# EAGLE design 1.0_batchpcb (EAGLE 5.11)
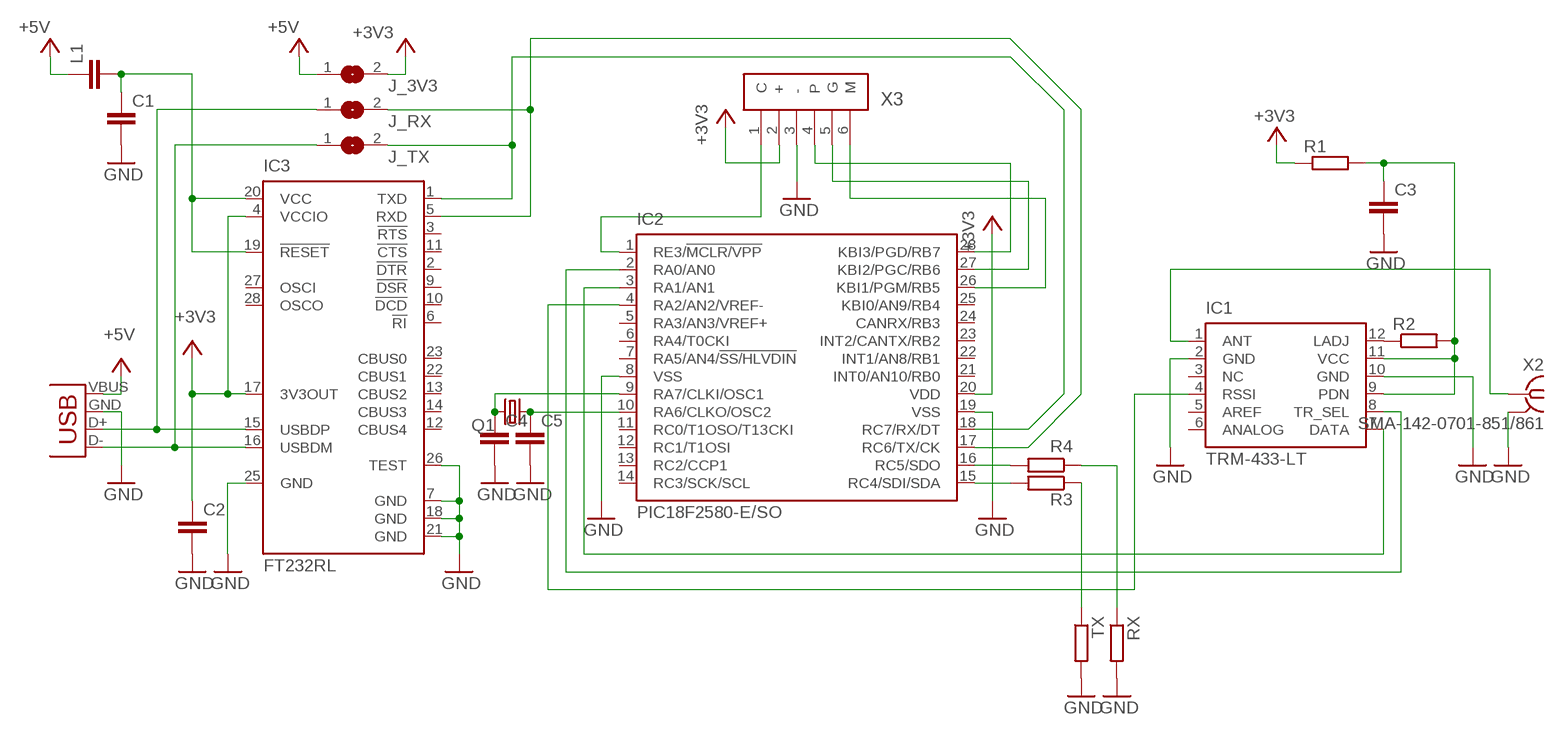
[diagram p0: schematic, sheet 1]

## Parts
C1  C-EUC0805K  [C0805K]
C2  C-EUC0805K  [C0805K]
C3  C-EUC0805K  [C0805K]
C4  C-EUC0805K  [C0805K]
C5  C-EUC0805K  [C0805K]
IC1  TRM-433-LT  [TRM-XXX-LT]
IC2  PIC18F2580-E/SO  [SO28W]
IC3  FT232RL  [SSOP28]
J_3V3  SJ  [SJ]
J_RX  SJ  [SJ]
J_TX  SJ  [SJ]
L1  C-EUC0805K  [C0805K]
Q1  CRYSTALSM49  [SM49]
R1  R-EU_M0805  [M0805]
R2  R-EU_M0805  [M0805]
R3  R-EU_M0805  [M0805]
R4  R-EU_M0805  [M0805]
RX  R-EU_M0805  [M0805]
TX  R-EU_M0805  [M0805]
X1  USB-A-H  [USB-A-H]
X2  SMA-142-0701-851/861  [J502-ND-142-0701-851/861]
X3  ICSP_HEADER  [6-PIN_HEADER]

## Nets
+3V3: C2.1 C3.1 IC1.9(PDN) IC1.11(VCC) IC2.20(VDD) IC3.4(VCCIO) IC3.17(3V3OUT) J_3V3.2 R1.1 R1.2 R2.2 X3.2(+)
+5V: J_3V3.1 L1.1 X1.VBUS(GND)
GND: C1.2 C2.2 C3.2 C4.2 C5.2 IC1.2(GND) IC1.10(GND) IC2.8(VSS) IC2.19(VSS) IC3.7(GND) IC3.18(GND) IC3.21(GND) IC3.25(GND) IC3.26(TEST) RX.2 TX.2 X1.GND(VBUS) X2.G@1(GND) X3.3(-)
N$1: IC1.1(ANT) X2.1
N$2: IC2.18(RC7/RX/DT) IC3.1(TXD) J_TX.2
N$3: IC2.17(RC6/TX/CK) IC3.5(RXD) J_RX.2
N$4: IC2.1(RE3/!MCLR/VPP) X3.1(C)
N$5: IC2.28(KBI3/PGD/RB7) X3.4(P)
N$6: IC2.27(KBI2/PGC/RB6) X3.5(G)
N$7: IC2.26(KBI1/PGM/RB5) X3.6(M)
N$8: IC1.7(DATA) IC2.3(RA1/AN1)
N$9: IC1.8(TR_SEL) IC2.2(RA0/AN0)
N$10: IC1.4(RSSI) IC2.4(RA2/AN2/VREF-)
N$11: IC1.12(LADJ) R2.1
N$12: IC3.16(USBDM) J_TX.1 X1.D-(D+)
N$13: IC2.16(RC5/SDO) R4.2
N$14: IC3.15(USBDP) J_RX.1 X1.D+(D-)
N$15: IC2.15(RC4/SDI/SDA) R3.2
N$16: C1.1 IC3.19(!RESET) IC3.20(VCC) L1.2
N$17: C4.1 IC2.9(RA7/CLKI/OSC1) Q1.2
N$18: R4.1 RX.1
N$19: R3.1 TX.1
N$21: C5.1 IC2.10(RA6/CLKO/OSC2) Q1.1
Unconnected: IC1.3(NC) IC1.5(AREF) IC1.6(ANALOG) IC2.5(RA3/AN3/VREF+) IC2.6(RA4/T0CKI) IC2.7(RA5/AN4/!SS/HLVDIN) IC2.11(RC0/T1OSO/T13CKI) IC2.12(RC1/T1OSI) IC2.13(RC2/CCP1) IC2.14(RC3/SCK/SCL) IC2.21(INT0/AN10/RB0) IC2.22(INT1/AN8/RB1) IC2.23(INT2/CANTX/RB2) IC2.24(CANRX/RB3) IC2.25(KBI0/AN9/RB4) IC3.2(!DTR) IC3.3(!RTS) IC3.6(!RI) IC3.9(!DSR) IC3.10(!DCD) IC3.11(!CTS) IC3.12(CBUS4) IC3.13(CBUS2) IC3.14(CBUS3) IC3.22(CBUS1) IC3.23(CBUS0) IC3.27(OSCI) IC3.28(OSCO)

## Power pins joined to a net without a drawn wire
GND: X2.G@2(GND) X2.G@3(GND) X2.G@4(GND)

## Library data of the parts
C1-C5 L1 = rcl:C-EU: CAPACITOR, European symbol
IC1 = linx:TRM-*-LT: LT SERIES TRANSCEIVER MODULE bidirectional wireless transfer serial data Source: www.linxtechnologies.com .. TRM-xxx-LT_Data_Guide.pdf; OC_FARNELL: unknown; OC_NEWARK: unknown
IC2 = microchip:PIC18F2*80: 28-Pin Enhanced Flash Microcontrollers with ECAN(TM) Technology 10-Bit A/D and nanoWatt Technology Source: http://www.microchip.com .. 39637a.pdf; MF: MICROCHIP; MPN: PIC18F2580-I/SO; OC_FARNELL: 9321284; OC_NEWARK: 71J7243
IC3 = ftdichip:FT232R: Source: http://www.ftdichip.com/Documents/DataSheets/DS_FT232R_v104.pdf; MPN: FT232RL; OC_FARNELL: 1146032; OC_NEWARK: 91K9918
J_3V3 J_RX J_TX = jumper:SJ: SMD solder JUMPER
Q1 = crystal:CRYSTAL: CRYSTAL; OC_FARNELL: unknown; OC_NEWARK: unknown
R1-R4 RX TX = rcl:R-EU_: RESISTOR, European symbol
X1 = SparkFun:USB: USB Connectors USB-B-PTH is fully proven SKU : PRT-00139 USB-miniB is fully proven SKU : PRT-00587 USB-A-PCB is untested. USB-A-H is throughly reviewed, but untested. Spark Fun Electronics SKU : PRT-00437 USB-B-SMT is throughly reviewed, but untested. Needs silkscreen touching up. USB-A-S has not been used/tested USB-MB-H has not been used/tested
X2 = con-coax2:SMA-: SMA 50 Ohm End Launch Jack Receptacle - Round Contact Johnson Components Source: www.johnsoncomponents.com .. J502-ND.pdf; MF: JOHNSON COMPONENTS; MPN: 142-0701-851; OC_FARNELL: 1019325; OC_NEWARK: 99F6798
X3 = 6pin2mmheader:ICSP_HEADER

## Board
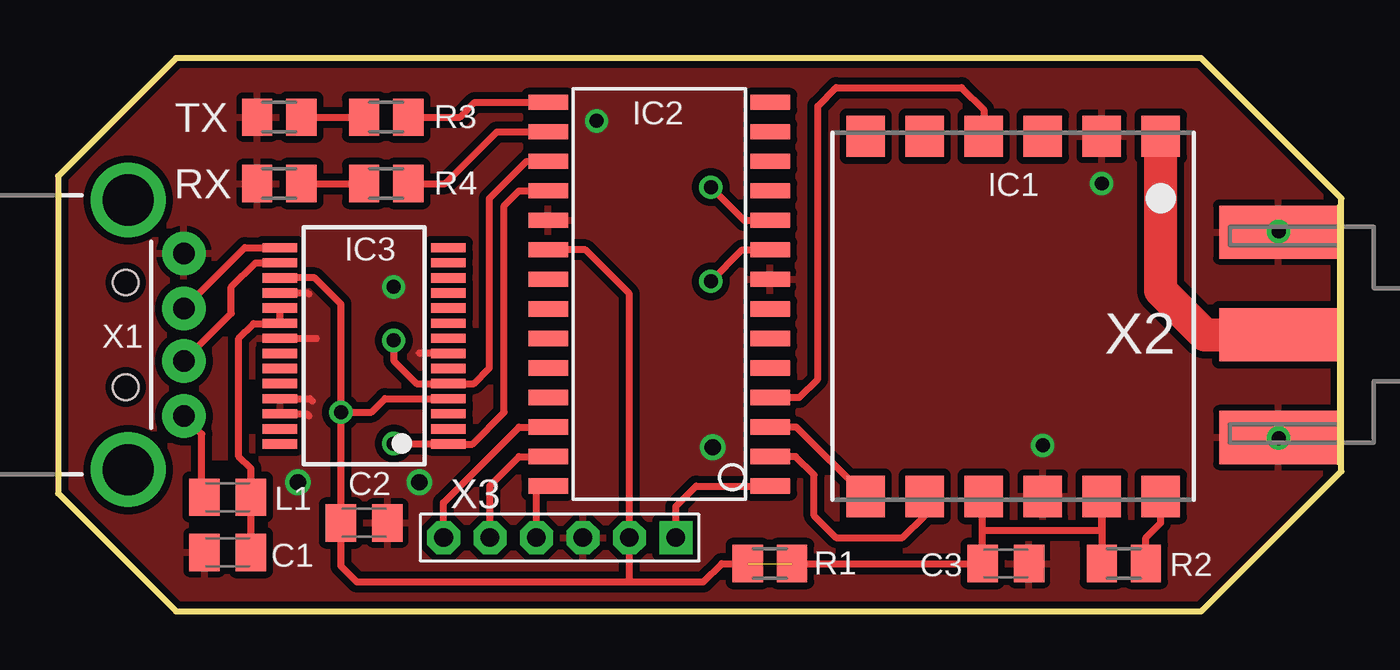
[diagram p1: board, top side]
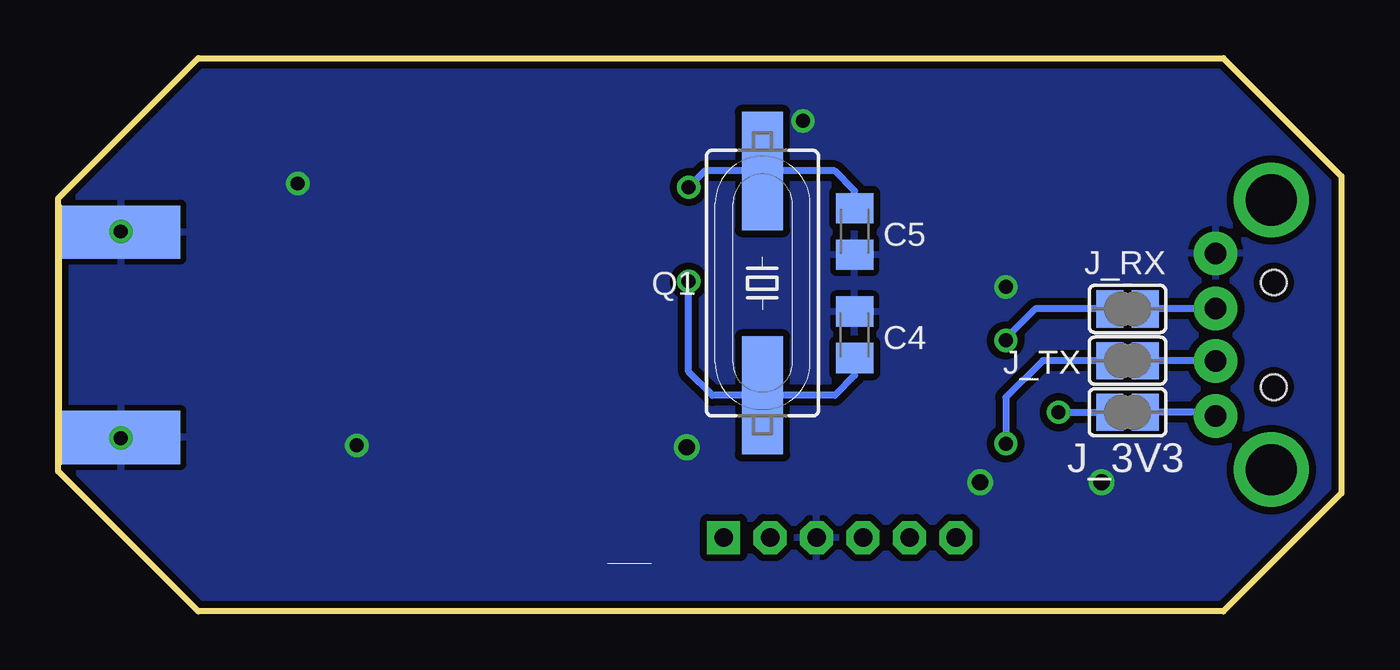
[diagram p2: board, bottom side, seen from below]

Size 55.25 x 23.81 mm. Coordinates in mm from the lower left corner, seen from the top.
Outline: 0,18.73 0,5.08 5.08,0 49.21,0 55.25,6.03 55.25,17.78 49.21,23.81 5.08,23.81 0,18.73
Copper layers (1*16): Top 0.035mm / dielectric 1.5mm / Bottom 0.035mm
Design rules "default *": minimum track width 10mil, minimum drill 24mil, track to track 8mil, track to pad 8mil, pad to pad 8mil, via to via 8mil, smd to smd 8mil, copper to edge 12mil, drill to drill 8mil, minimum pad ring 10mil, minimum via ring 8mil, stop-mask expansion 4mil, vias tented up to drill 0.8mm, thermal gap 10mil
tRestrict: area 6.8,12.7 to 8.4,14.3; area 6.8,12.4 to 8.4,14.3; area 19.2,6.7 to 20.5,17.5; area 6.5,2.9 to 7.8,6; area 45.2,2.9 to 47.3,3.5; 4 lines

### Footprints (pad centres in the part's own frame; a part is rotated, then mirrored left to right if it is on the bottom)
C0805K = smd 1.3 x 1.6: 1 -1,0; 2 1,0
TRM-XXX-LT = smd 1.651 x 1.778: 1 -6.35,-7.747; 2 -3.81,-7.747; 3 -1.27,-7.747; 4 1.27,-7.747; 5 3.81,-7.747; 6 6.35,-7.747; 7 6.35,7.747; 8 3.81,7.747; 9 1.27,7.747; 10 -1.27,7.747; 11 -3.81,7.747; 12 -6.35,7.747
SO28W = smd 0.65 x 1.7: 1 -7.62,-4.78; 2 -6.35,-4.78; 3 -5.08,-4.78; 4 -3.81,-4.78; 5 -2.54,-4.78; 6 -1.27,-4.78; 7 0,-4.78; 8 1.27,-4.78; 9 2.54,-4.78; 10 3.81,-4.78; 11 5.08,-4.78; 12 6.35,-4.78; 13 7.62,-4.78; 14 8.89,-4.78; 15 8.89,4.78; 16 7.62,4.78; 17 6.35,4.78; 18 5.08,4.78; 19 3.81,4.78; 20 2.54,4.78; 21 1.27,4.78; 22 0,4.78; 23 -1.27,4.78; 24 -2.54,4.78; 25 -3.81,4.78; 26 -5.08,4.78; 27 -6.35,4.78; 28 -7.62,4.78
SSOP28 = smd 0.4 x 1.5: 1 -4.225,-3.625; 2 -3.575,-3.625; 3 -2.925,-3.625; 4 -2.275,-3.625; 5 -1.625,-3.625; 6 -0.975,-3.625; 7 -0.325,-3.625; 8 0.325,-3.625; 9 0.975,-3.625; 10 1.625,-3.625; 11 2.275,-3.625; 12 2.925,-3.625; 13 3.575,-3.625; 14 4.225,-3.625; 15 4.225,3.625; 16 3.575,3.625; 17 2.925,3.625; 18 2.275,3.625; 19 1.625,3.625; 20 0.975,3.625; 21 0.325,3.625; 22 -0.325,3.625; 23 -0.975,3.625; 24 -1.625,3.625; 25 -2.275,3.625; 26 -2.925,3.625; 27 -3.575,3.625; 28 -4.225,3.625
SJ = smd 1.168 x 1.6: 1 -0.762,0; 2 0.762,0
SM49 = smd 5.08 x 1.778: 1 -4.826,0; 2 4.826,0
M0805 = smd 1.3 x 1.6: 1 -0.95,0; 2 0.95,0
USB-A-H = drill 0.914 pad 1.88 round: D+ 2.4,1.127; D- 2.4,-1.127; GND 2.4,3.5; VBUS 2.4,-3.5 | drill 2.2 round: GND2 0,-5.8; GND3 0,5.8 | hole 1.1: -0.1,2.25; -0.1,-2.25
J502-ND-142-0701-851/861 = smd 5.08 x 2.286: 1 2.565,0; G@1 2.565,4.42; G@2 2.565,-4.42 | smd 5.08 x 2.286 bottom: G@3 2.565,4.42; G@4 2.565,-4.42
6-PIN_HEADER = drill 0.8 pad 1.422 square: 1 -5.004,0 | drill 0.8 pad 1.422 octagon: 2 -3.004,0; 3 -1.004,0; 4 0.996,0; 5 2.996,0; 6 4.996,0

### Placement (x,y rotation side)
C1  7.3,2.54 180 top
C2  13.18,3.81 0 top
C3  40.8,2.06 0 top
C4  20.96,11.91 90 bottom
C5  20.95,16.35 270 bottom
IC1  41.12,12.7 180 top
IC2  25.88,13.02 90 top
IC3  13.18,11.43 90 top
J_3V3  9.21,8.57 180 bottom
J_RX  9.21,13.02 180 bottom
J_TX  9.21,10.79 180 bottom
L1  7.3,4.92 0 top
Q1  24.92,14.13 270 bottom
R1  30.64,2.06 0 top
R2  45.88,2.06 180 top
R3  14.13,21.27 0 top
R4  14.13,18.41 0 top
RX  9.52,18.41 180 top
TX  9.53,21.27 180 top
X1  3.02,11.91 0 top
X2  55.09,11.91 180 top
X3  21.59,3.17 180 top

### Tracks (layer width: path | path; a pad name or v marks a point on that pad's centre or on a via)
+3V3  (via drill 0.6)  (1 unrouted)
  Top 0.305: R1.2 C3.1 39.8,3.49 | 39.8,3.49 39.8,4.11 IC1.9 | 24.61,1.27 12.86,1.27 12.18,1.95 C2.1 v12.18,8.57 | 24.61,1.27 27.78,1.27 28.58,2.06 R1.1 | R2.2 44.93,3.68 IC1.11 44.93,3.49 39.8,3.49 | 24.61,1.27 24.61,3.16 X3.2 24.59,13.67 22.7,15.56 IC2.20 | IC3.17 11.05,14.35 12.18,13.22 v12.18,8.57 | IC3.4 14.08,9.16 13.49,8.57 v12.18,8.57
  Bottom 0.305: v12.18,8.57 J_3V3.2 | v12.18,8.57
  other vias: 12.18,8.57
+5V
  Top 0.305: L1.1 6.19,4.97 6.19,7.63 X1.VBUS
  Bottom 0.305: J_3V3.1 5.58,8.57 X1.VBUS
GND  (via drill 0.6, 0.7)
  Top 0.305: IC3.26 10.7,8.51 10.8,8.41 | IC3.18 10.74,13.71 10.8,13.65 | IC3.21 11.11,11.75 | IC3.7 15.57,11.1 15.56,11.11 | IC3.25 10.85,9.16 10.95,9.05
  other vias: 14.45,13.97 23.18,21.11 42.39,7.14 44.93,18.41 52.55,16.35 52.55,7.46 10.32,5.56 15.56,5.56 28.18,7.06
  pour Top (isolate 0.305): -0.16,4.6 0.32,18.73 5.56,23.97 49.37,23.81 55.24,17.62 55.09,5.87 49.21,0 4.92,-0.48
  pour Bottom (isolate 0.305): 0,18.73 5.87,23.81 49.21,23.81 55.4,17.78 55.25,5.87 49.85,0.16 4.76,-0.32 -0.16,4.76
N$1
  Top 1.422: IC1.1 47.47,13.81 49.37,11.91 X2.1 | X2.1
N$2  (via drill 0.6)
  Top 0.305: IC2.18 19.84,18.1 19.21,17.46 19.21,8.57 17.84,7.2 IC3.1 16.78,7.22 v14.45,7.22
  Bottom 0.305: J_TX.2 12.86,10.79 14.45,9.21 v14.45,7.22
N$3  (via drill 0.6)
  Top 0.305: IC2.17 20.16,19.37 18.57,17.78 18.57,10.48 17.9,9.81 IC3.5 15.44,9.81 14.45,10.79 v14.45,11.67
  Bottom 0.305: v14.45,11.67 14.45,11.75 13.18,13.02 J_RX.2 | J_RX.2
N$4
  Top 0.305: IC2.1 27.46,5.4 26.59,4.53 X3.1
N$5
  Top 0.305: 20.64,5.4 20.48,5.4 20.67,5.21 | 20.64,5.4 IC2.28 | X3.4 20.59,5.35 20.64,5.4
N$6
  Top 0.305: IC2.27 19.84,6.67 18.59,5.42 X3.5
N$7
  Top 0.305: IC2.26 19.84,7.94 16.59,4.69 X3.6
N$8
  Top 0.305: 34.89,4.6 IC1.7 31.78,7.94 IC2.3
N$9
  Top 0.305: IC1.8 37.31,4.13 36.35,3.18 33.5,3.18 32.54,4.13 32.54,5.87 31.75,6.67 IC2.2
N$10
  Top 0.305: IC2.4 31.91,9.21 32.7,10 32.7,21.75 33.5,22.54 38.89,22.54 39.85,21.59 IC1.4
N$11
  Top 0.305: IC1.12 47.47,3.81 46.83,3.18 46.83,2.54 R2.1
N$12
  Top 0.305: X1.D- 7.46,12.82 7.46,13.97 8.5,15 IC3.16
  Bottom 0.305: J_TX.1 5.43,10.79 X1.D-
N$13
  Top 0.305: R4.2 16.67,18.41 18.89,20.64 IC2.16
N$14
  Top 0.305: X1.D+ 8.04,15.66 IC3.15
  Bottom 0.305: J_RX.1 5.43,13.02 X1.D+
N$15
  Top 0.305: R3.2 17.3,21.27 17.94,21.91 IC2.15
N$16
  Top 0.305: IC3.19 IC3.20 9.53,12.38 8.41,12.38 7.78,11.75 7.78,6.67 8.3,6.14 L1.2 8.3,2.22 C1.1 8.29,2.37
N$17  (via drill 0.6)
  Top 0.305: v28.1,14.21 29.45,15.56 IC2.9
  Bottom 0.305: C4.1 20.96,10.75 20.96,10.16 21.81,9.3 Q1.2 27.08,9.3 28.1,10.32 v28.1,14.21
N$18
  Top 0.305: RX.1 R4.1
N$19
  Top 0.305: TX.1 R3.1 | R3.1
N$21  (via drill 0.6)
  Top 0.305: IC2.10 29.53,16.83 v28.1,18.26
  Bottom 0.305: C5.1 20.96,18.1 21.81,18.95 Q1.1 27.4,18.95 v28.1,18.26

### Text on the board
_bsilk: MultiTRX V3 | skagmo.com